# Altium schematic sheet CRSC0002.SchDoc: Critical system computer - Microcontroller
size A3; Engineer: Sam Shan Jiang; DocumentNumber: CRSC0002; SheetNumber: 2; SheetTotal: 5; Description: LPC2468 microcontroller; Version: 1.0
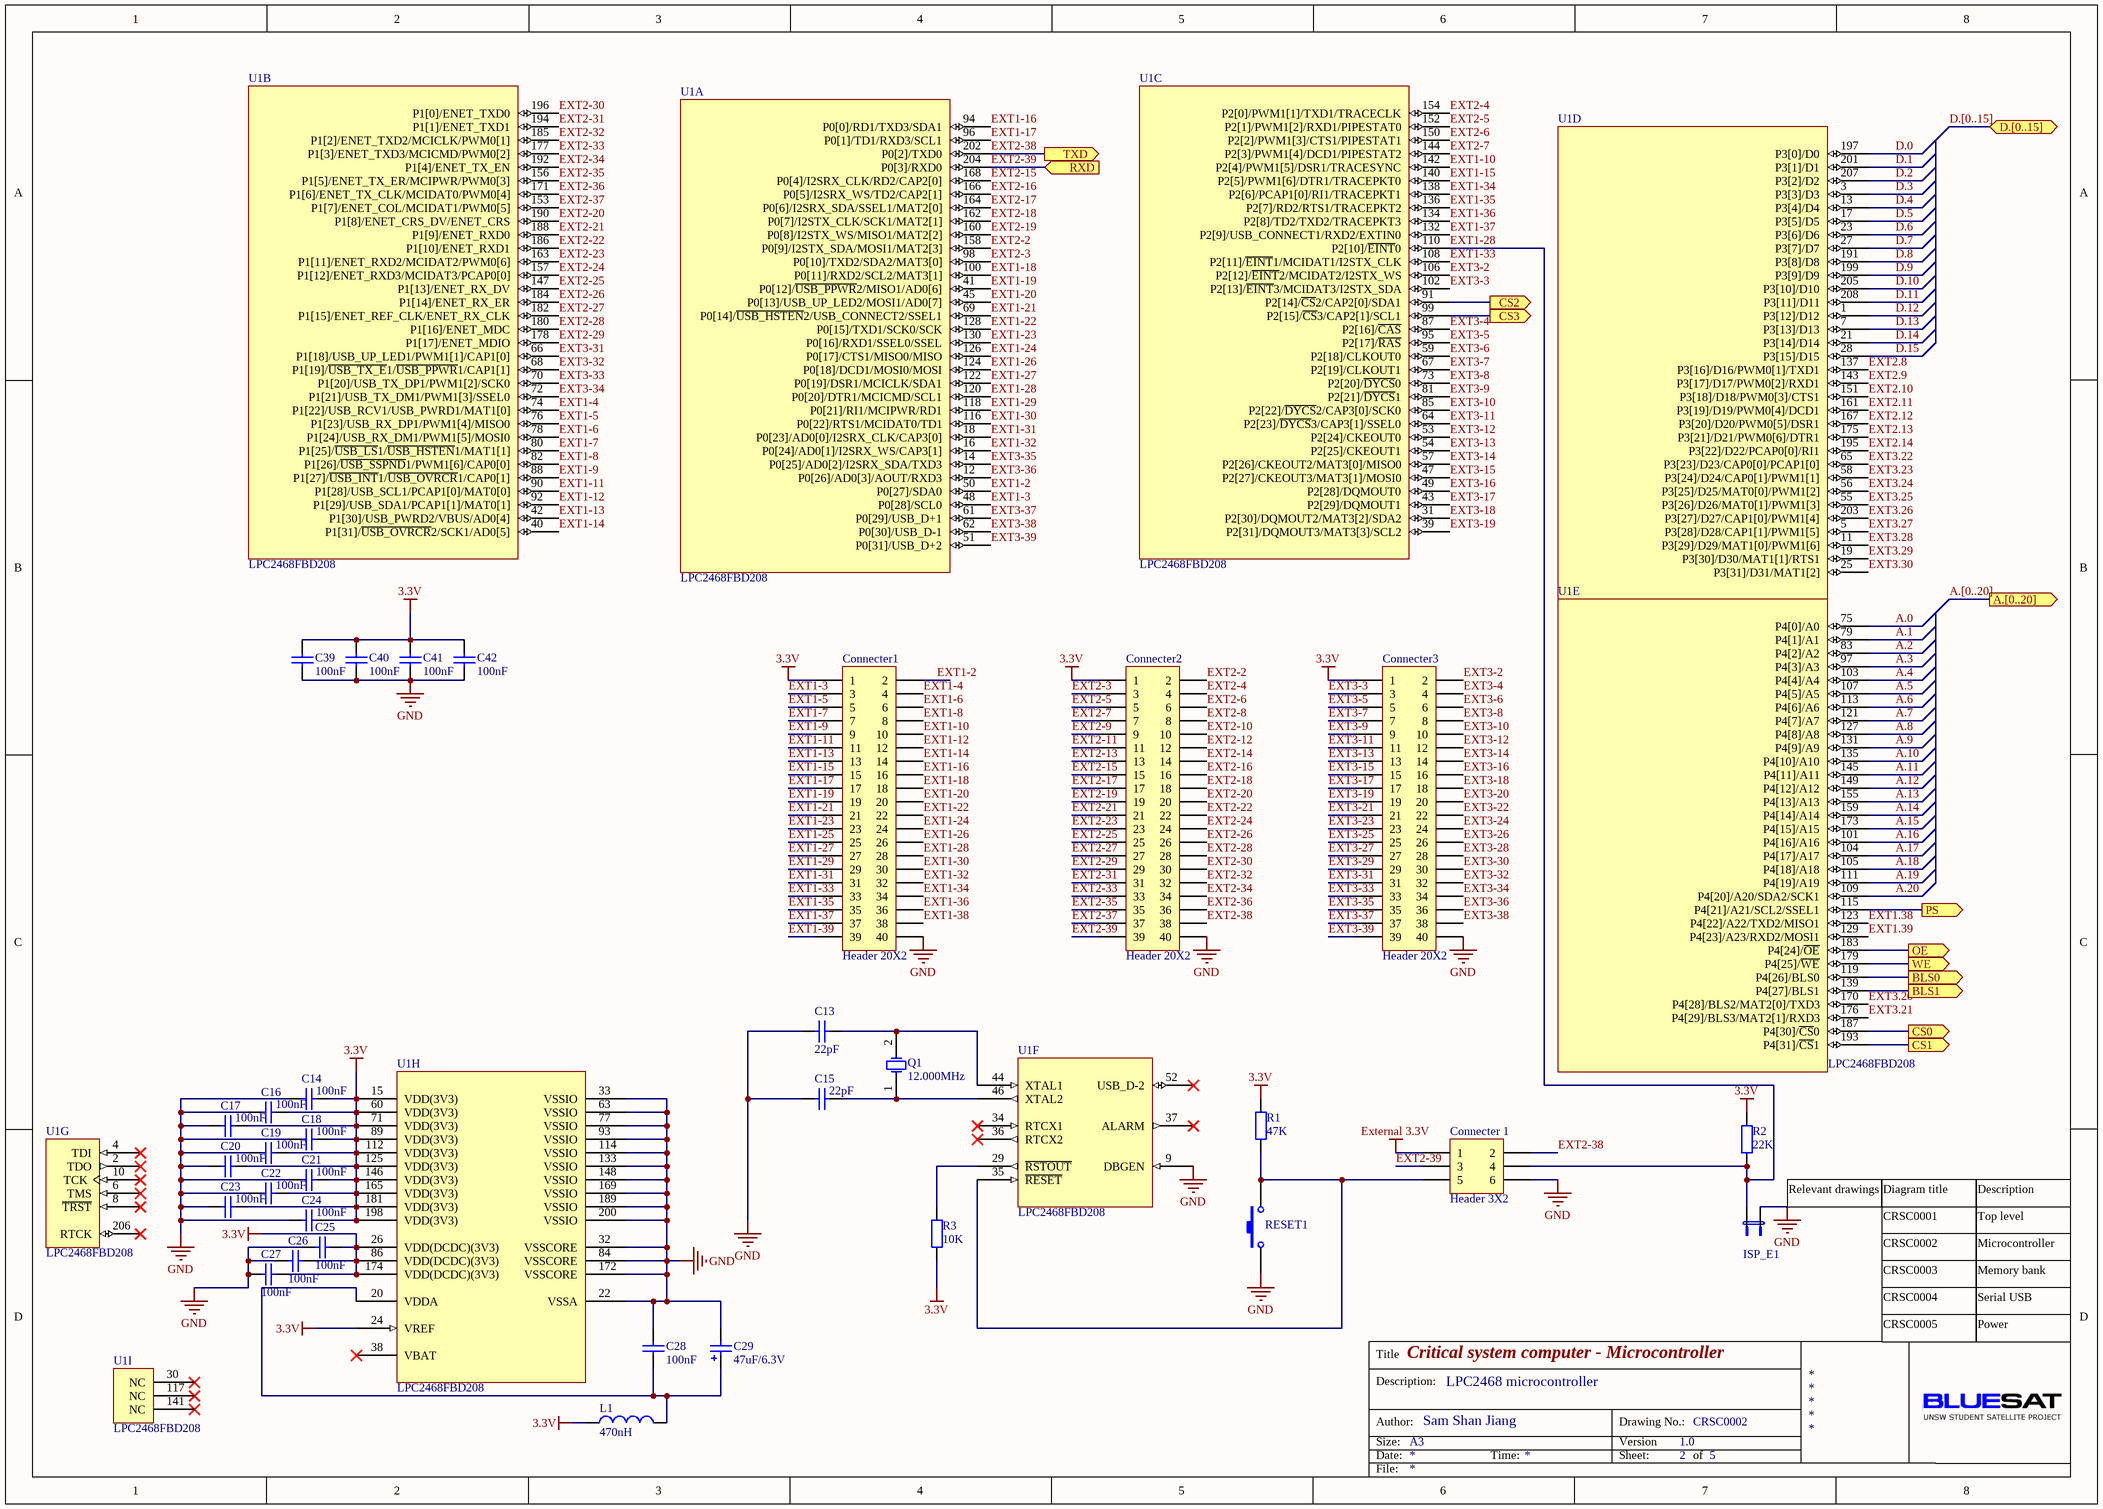
[diagram p0: CRSC0002.SchDoc]

## Parts
C13  22pF  [0805]
C14  100nF  [0805]
C15  22pF  [0805]
C16  100nF  [0805]
C17  100nF  [0805]
C18  100nF  [0805]
C19  100nF  [0805]
C20  100nF  [0805]
C21  100nF  [0805]
C22  100nF  [0805]
C23  100nF  [0805]
C24  100nF  [0805]
C25  100nF  [0805]
C26  100nF  [0805]
C27  100nF  [0805]
C28  100nF  [0805]
C29  47uF/6.3V  [1206]
C39  value 100nF  [0805]  (hidden comment: Cap)
C40  value 100nF  [0805]  (hidden comment: Cap)
C41  value 100nF  [0805]  (hidden comment: Cap)
C42  value 100nF  [0805]  (hidden comment: Cap)
Connecter1  Header 20X2  [40pins header]
Connecter2  Header 20X2  [40pins header]
Connecter3  Header 20X2  [40pins header]
Connecter_1  Header 3X2  [6pins header]
ISP_E1  2pins jumper  [JUMPER2pins]  (value not drawn)
L1  470nH  [0805]
Q1  12.000MHz  [HC49/4H_SMX]
R1  47K  [0805]
R2  22K  [0805]
R3  10K  [0805]
RESET1  SW-PB  [E-BIP-P4/D10]  (value not drawn)
U1  LPC2468FBD208  [SOT459-1_M]  (parts A,B,C,D,E,F,G,H,I of 9)

## Ports
A.[0..20] (out), BLS0 (out), BLS1 (out), CS0 (out), CS1 (out), CS2 (out), CS3 (out), D.[0..15] (bidir), OE (out), PS (out), RXD (in), TXD (out), WE (out)

## Nets
3.3V: C14.2 C16.2 C17.2 C18.2 C19.2 C20.2 C21.2 C22.2 C23.2 C24.2 C25.2 C26.2 C27.2 C39.2 C40.2 C41.2 C42.2 Connecter1.1 Connecter2.1 Connecter3.1 L1.1 R1.2 R2.2 R3.2 U1.15(VDD(3V3)) U1.24(VREF) U1.26(VDD(DCDC)(3V3)) U1.60(VDD(3V3)) U1.71(VDD(3V3)) U1.86(VDD(DCDC)(3V3)) U1.89(VDD(3V3)) U1.112(VDD(3V3)) U1.125(VDD(3V3)) U1.146(VDD(3V3)) U1.165(VDD(3V3)) U1.174(VDD(DCDC)(3V3)) U1.181(VDD(3V3)) U1.198(VDD(3V3))
External 3.3V: Connecter_1.1
GND: C13.2 C14.1 C15.2 C16.1 C17.1 C18.1 C19.1 C20.1 C21.1 C22.1 C23.1 C24.1 C25.1 C26.1 C27.1 C28.2 C29.2 C39.1 C40.1 C41.1 C42.1 Connecter1.40 Connecter2.40 Connecter3.40 Connecter_1.6 ISP_E1.2 RESET1.1 U1.9(DBGEN) U1.22(VSSA) U1.32(VSSCORE) U1.33(VSSIO) U1.63(VSSIO) U1.77(VSSIO) U1.84(VSSCORE) U1.93(VSSIO) U1.114(VSSIO) U1.133(VSSIO) U1.148(VSSIO) U1.169(VSSIO) U1.172(VSSCORE) U1.189(VSSIO) U1.200(VSSIO)
A.0: U1.75(P4[0]/A0)
A.1: U1.79(P4[1]/A1)
A.2: U1.83(P4[2]/A2)
A.3: U1.97(P4[3]/A3)
A.4: U1.103(P4[4]/A4)
A.5: U1.107(P4[5]/A5)
A.6: U1.113(P4[6]/A6)
A.7: U1.121(P4[7]/A7)
A.8: U1.127(P4[8]/A8)
A.9: U1.131(P4[9]/A9)
A.10: U1.135(P4[10]/A10)
A.11: U1.145(P4[11]/A11)
A.12: U1.149(P4[12]/A12)
A.13: U1.155(P4[13]/A13)
A.14: U1.159(P4[14]/A14)
A.15: U1.173(P4[15]/A15)
A.16: U1.101(P4[16]/A16)
A.17: U1.104(P4[17]/A17)
A.18: U1.105(P4[18]/A18)
A.19: U1.111(P4[19]/A19)
A.20: U1.109(P4[20]/A20/SDA2/SCK1)
BLS0: U1.119(P4[26]/BLS0) ; port BLS0
BLS1: U1.139(P4[27]/BLS1) ; port BLS1
CS0: U1.187(P4[30]/~{CS}0) ; port CS0
CS1: U1.193(P4[31]/~{CS}1) ; port CS1
CS2: U1.91(P2[14]/~{CS}2/CAP2[0]/SDA1) ; port CS2
CS3: U1.99(P2[15]/~{CS}3/CAP2[1]/SCL1) ; port CS3
D.0: U1.197(P3[0]/D0)
D.1: U1.201(P3[1]/D1)
D.2: U1.207(P3[2]/D2)
D.3: U1.3(P3[3]/D3)
D.4: U1.13(P3[4]/D4)
D.5: U1.17(P3[5]/D5)
D.6: U1.23(P3[6]/D6)
D.7: U1.27(P3[7]/D7)
D.8: U1.191(P3[8]/D8)
D.9: U1.199(P3[9]/D9)
D.10: U1.205(P3[10]/D10)
D.11: U1.208(P3[11]/D11)
D.12: U1.1(P3[12]/D12)
D.13: U1.7(P3[13]/D13)
D.14: U1.21(P3[14]/D14)
D.15: U1.28(P3[15]/D15)
EXT1-2: Connecter1.2 U1.50(P0[27]/SDA0)
EXT1-3: Connecter1.3 U1.48(P0[28]/SCL0)
EXT1-4: Connecter1.4 U1.74(P1[22]/USB_RCV1/USB_PWRD1/MAT1[0])
EXT1-5: Connecter1.5 U1.76(P1[23]/USB_RX_DP1/PWM1[4]/MISO0)
EXT1-6: Connecter1.6 U1.78(P1[24]/USB_RX_DM1/PWM1[5]/MOSI0)
EXT1-7: Connecter1.7 U1.80(P1[25]/~{USB_LS}1/~{USB_HSTEN}1/MAT1[1])
EXT1-8: Connecter1.8 U1.82(P1[26]/~{USB_SSPND}1/PWM1[6]/CAP0[0])
EXT1-9: Connecter1.9 U1.88(P1[27]/~{USB_INT}1/~{USB_OVRCR}1/CAP0[1])
EXT1-10: Connecter1.10 U1.142(P2[4]/PWM1[5]/DSR1/TRACESYNC)
EXT1-11: Connecter1.11 U1.90(P1[28]/USB_SCL1/PCAP1[0]/MAT0[0])
EXT1-12: Connecter1.12 U1.92(P1[29]/USB_SDA1/PCAP1[1]/MAT0[1])
EXT1-13: Connecter1.13 U1.42(P1[30]/USB_PWRD2/VBUS/AD0[4])
EXT1-14: Connecter1.14 U1.40(P1[31]/~{USB_OVRCR}2/SCK1/AD0[5])
EXT1-15: Connecter1.15 U1.140(P2[5]/PWM1[6]/DTR1/TRACEPKT0)
EXT1-16: Connecter1.16 U1.94(P0[0]/RD1/TXD3/SDA1)
EXT1-17: Connecter1.17 U1.96(P0[1]/TD1/RXD3/SCL1)
EXT1-18: Connecter1.18 U1.100(P0[11]/RXD2/SCL2/MAT3[1])
EXT1-19: Connecter1.19 U1.41(P0[12]/~{USB_PPWR}2/MISO1/AD0[6])
EXT1-20: Connecter1.20 U1.45(P0[13]/USB_UP_LED2/MOSI1/AD0[7])
EXT1-21: Connecter1.21 U1.69(P0[14]/~{USB_HSTEN}2/USB_CONNECT2/SSEL1)
EXT1-22: Connecter1.22 U1.128(P0[15]/TXD1/SCK0/SCK)
EXT1-23: Connecter1.23 U1.130(P0[16]/RXD1/SSEL0/SSEL)
EXT1-24: Connecter1.24 U1.126(P0[17]/CTS1/MISO0/MISO)
EXT1-25: Connecter1.25
EXT1-26: Connecter1.26 U1.124(P0[18]/DCD1/MOSI0/MOSI)
EXT1-27: Connecter1.27 U1.122(P0[19]/DSR1/MCICLK/SDA1)
EXT1-28: Connecter1.28 Connecter_1.4 ISP_E1.1 R2.1 U1.110(P2[10]/~{EINT}0) U1.120(P0[20]/DTR1/MCICMD/SCL1)
EXT1-29: Connecter1.29 U1.118(P0[21]/RI1/MCIPWR/RD1)
EXT1-30: Connecter1.30 U1.116(P0[22]/RTS1/MCIDAT0/TD1)
EXT1-31: Connecter1.31 U1.18(P0[23]/AD0[0]/I2SRX_CLK/CAP3[0])
EXT1-32: Connecter1.32 U1.16(P0[24]/AD0[1]/I2SRX_WS/CAP3[1])
EXT1-33: Connecter1.33 U1.108(P2[11]/~{EINT}1/MCIDAT1/I2STX_CLK)
EXT1-34: Connecter1.34 U1.138(P2[6]/PCAP1[0]/RI1/TRACEPKT1)
EXT1-35: Connecter1.35 U1.136(P2[7]/RD2/RTS1/TRACEPKT2)
EXT1-36: Connecter1.36 U1.134(P2[8]/TD2/TXD2/TRACEPKT3)
EXT1-37: Connecter1.37 U1.132(P2[9]/USB_CONNECT1/RXD2/EXTIN0)
EXT1-38: Connecter1.38
EXT1-39: Connecter1.39
EXT1.38: U1.123(P4[22]/A22/TXD2/MISO1)
EXT1.39: U1.129(P4[23]/A23/RXD2/MOSI1)
EXT2-2: Connecter2.2 U1.158(P0[9]/I2STX_SDA/MOSI1/MAT2[3])
EXT2-3: Connecter2.3 U1.98(P0[10]/TXD2/SDA2/MAT3[0])
EXT2-4: Connecter2.4 U1.154(P2[0]/PWM1[1]/TXD1/TRACECLK)
EXT2-5: Connecter2.5 U1.152(P2[1]/PWM1[2]/RXD1/PIPESTAT0)
EXT2-6: Connecter2.6 U1.150(P2[2]/PWM1[3]/CTS1/PIPESTAT1)
EXT2-7: Connecter2.7 U1.144(P2[3]/PWM1[4]/DCD1/PIPESTAT2)
EXT2-8: Connecter2.8
EXT2-9: Connecter2.9
EXT2-10: Connecter2.10
EXT2-11: Connecter2.11
EXT2-12: Connecter2.12
EXT2-13: Connecter2.13
EXT2-14: Connecter2.14
EXT2-15: Connecter2.15 U1.168(P0[4]/I2SRX_CLK/RD2/CAP2[0])
EXT2-16: Connecter2.16 U1.166(P0[5]/I2SRX_WS/TD2/CAP2[1])
EXT2-17: Connecter2.17 U1.164(P0[6]/I2SRX_SDA/SSEL1/MAT2[0])
EXT2-18: Connecter2.18 U1.162(P0[7]/I2STX_CLK/SCK1/MAT2[1])
EXT2-19: Connecter2.19 U1.160(P0[8]/I2STX_WS/MISO1/MAT2[2])
EXT2-20: Connecter2.20 U1.190(P1[8]/ENET_CRS_DV/ENET_CRS)
EXT2-21: Connecter2.21 U1.188(P1[9]/ENET_RXD0)
EXT2-22: Connecter2.22 U1.186(P1[10]/ENET_RXD1)
EXT2-23: Connecter2.23 U1.163(P1[11]/ENET_RXD2/MCIDAT2/PWM0[6])
EXT2-24: Connecter2.24 U1.157(P1[12]/ENET_RXD3/MCIDAT3/PCAP0[0])
EXT2-25: Connecter2.25 U1.147(P1[13]/ENET_RX_DV)
EXT2-26: Connecter2.26 U1.184(P1[14]/ENET_RX_ER)
EXT2-27: Connecter2.27 U1.182(P1[15]/ENET_REF_CLK/ENET_RX_CLK)
EXT2-28: Connecter2.28 U1.180(P1[16]/ENET_MDC)
EXT2-29: Connecter2.29 U1.178(P1[17]/ENET_MDIO)
EXT2-30: Connecter2.30 U1.196(P1[0]/ENET_TXD0)
EXT2-31: Connecter2.31 U1.194(P1[1]/ENET_TXD1)
EXT2-32: Connecter2.32 U1.185(P1[2]/ENET_TXD2/MCICLK/PWM0[1])
EXT2-33: Connecter2.33 U1.177(P1[3]/ENET_TXD3/MCICMD/PWM0[2])
EXT2-34: Connecter2.34 U1.192(P1[4]/ENET_TX_EN)
EXT2-35: Connecter2.35 U1.156(P1[5]/ENET_TX_ER/MCIPWR/PWM0[3])
EXT2-36: Connecter2.36 U1.171(P1[6]/ENET_TX_CLK/MCIDAT0/PWM0[4])
EXT2-37: Connecter2.37 U1.153(P1[7]/ENET_COL/MCIDAT1/PWM0[5])
EXT2-38: Connecter2.38 Connecter_1.2 U1.202(P0[2]/TXD0) ; port TXD
EXT2-39: Connecter2.39 Connecter_1.3 U1.204(P0[3]/RXD0) ; port RXD
EXT2.8: U1.137(P3[16]/D16/PWM0[1]/TXD1)
EXT2.9: U1.143(P3[17]/D17/PWM0[2]/RXD1)
EXT2.10: U1.151(P3[18]/D18/PWM0[3]/CTS1)
EXT2.11: U1.161(P3[19]/D19/PWM0[4]/DCD1)
EXT2.12: U1.167(P3[20]/D20/PWM0[5]/DSR1)
EXT2.13: U1.175(P3[21]/D21/PWM0[6]/DTR1)
EXT2.14: U1.195(P3[22]/D22/PCAP0[0]/RI1)
EXT3-2: Connecter3.2 U1.106(P2[12]/~{EINT}2/MCIDAT2/I2STX_WS)
EXT3-3: Connecter3.3 U1.102(P2[13]/~{EINT}3/MCIDAT3/I2STX_SDA)
EXT3-4: Connecter3.4 U1.87(P2[16]/~{CAS})
EXT3-5: Connecter3.5 U1.95(P2[17]/~{RAS})
EXT3-6: Connecter3.6 U1.59(P2[18]/CLKOUT0)
EXT3-7: Connecter3.7 U1.67(P2[19]/CLKOUT1)
EXT3-8: Connecter3.8 U1.73(P2[20]/~{DYCS}0)
EXT3-9: Connecter3.9 U1.81(P2[21]/~{DYCS}1)
EXT3-10: Connecter3.10 U1.85(P2[22]/~{DYCS}2/CAP3[0]/SCK0)
EXT3-11: Connecter3.11 U1.64(P2[23]/~{DYCS}3/CAP3[1]/SSEL0)
EXT3-12: Connecter3.12 U1.53(P2[24]/CKEOUT0)
EXT3-13: Connecter3.13 U1.54(P2[25]/CKEOUT1)
EXT3-14: Connecter3.14 U1.57(P2[26]/CKEOUT2/MAT3[0]/MISO0)
EXT3-15: Connecter3.15 U1.47(P2[27]/CKEOUT3/MAT3[1]/MOSI0)
EXT3-16: Connecter3.16 U1.49(P2[28]/DQMOUT0)
EXT3-17: Connecter3.17 U1.43(P2[29]/DQMOUT1)
EXT3-18: Connecter3.18 U1.31(P2[30]/DQMOUT2/MAT3[2]/SDA2)
EXT3-19: Connecter3.19 U1.39(P2[31]/DQMOUT3/MAT3[3]/SCL2)
EXT3-20: Connecter3.20
EXT3-21: Connecter3.21
EXT3-22: Connecter3.22
EXT3-23: Connecter3.23
EXT3-24: Connecter3.24
EXT3-25: Connecter3.25
EXT3-26: Connecter3.26
EXT3-27: Connecter3.27
EXT3-28: Connecter3.28
EXT3-29: Connecter3.29
EXT3-30: Connecter3.30
EXT3-31: Connecter3.31 U1.66(P1[18]/USB_UP_LED1/PWM1[1]/CAP1[0])
EXT3-32: Connecter3.32 U1.68(P1[19]/~{USB_TX_E}1/~{USB_PPWR}1/CAP1[1])
EXT3-33: Connecter3.33 U1.70(P1[20]/USB_TX_DP1/PWM1[2]/SCK0)
EXT3-34: Connecter3.34 U1.72(P1[21]/USB_TX_DM1/PWM1[3]/SSEL0)
EXT3-35: Connecter3.35 U1.14(P0[25]/AD0[2]/I2SRX_SDA/TXD3)
EXT3-36: Connecter3.36 U1.12(P0[26]/AD0[3]/AOUT/RXD3)
EXT3-37: Connecter3.37 U1.61(P0[29]/USB_D+1)
EXT3-38: Connecter3.38 U1.62(P0[30]/USB_D-1)
EXT3-39: Connecter3.39 U1.51(P0[31]/USB_D+2)
EXT3.20: U1.170(P4[28]/BLS2/MAT2[0]/TXD3)
EXT3.21: U1.176(P4[29]/BLS3/MAT2[1]/RXD3)
EXT3.22: U1.65(P3[23]/D23/CAP0[0]/PCAP1[0])
EXT3.23: U1.58(P3[24]/D24/CAP0[1]/PWM1[1])
EXT3.24: U1.56(P3[25]/D25/MAT0[0]/PWM1[2])
EXT3.25: U1.55(P3[26]/D26/MAT0[1]/PWM1[3])
EXT3.26: U1.203(P3[27]/D27/CAP1[0]/PWM1[4])
EXT3.27: U1.5(P3[28]/D28/CAP1[1]/PWM1[5])
EXT3.28: U1.11(P3[29]/D29/MAT1[0]/PWM1[6])
EXT3.29: U1.19(P3[30]/D30/MAT1[1]/RTS1)
EXT3.30: U1.25(P3[31]/D31/MAT1[2])
OE: U1.183(P4[24]/~{OE}) ; port OE
PS: U1.115(P4[21]/A21/SCL2/SSEL1) ; port PS
WE: U1.179(P4[25]/~{WE}) ; port WE
NetC13_1: C13.1 Q1.2(OSC2) U1.44(XTAL1)
NetC15_1: C15.1 Q1.1(OSC1) U1.46(XTAL2)
NetC28_1: C28.1 C29.1 L1.2 U1.20(VDDA)
NetConnecter_1_5: Connecter_1.5 R1.1 RESET1.2 U1.35(~{RESET})
NetR3_1: R3.1 U1.29(~{RSTOUT})

Not connected (* = marked no-connect by the designer): U1 2(TDO)* 4(TDI)* 6(TMS)* 8(~{TRST})* 10(TCK)* 30(NC)* 34(RTCX1)* 36(RTCX2)* 37(ALARM)* 38(VBAT)* 52(USB_D-2)* 117(NC)* 141(NC)* 206(RTCK)*

## Buses and harness runs
bus A.[0..20] = port A.[0..20]
bus D.[0..15] = port D.[0..15]

## Notes on the sheet
- Relevant drawings
- CRSC0001
- CRSC0002
- Diagram title
- Top level
- Microcontroller
- Description
- CRSC0003
- CRSC0004
- Memory bank
- Serial USB
- CRSC0005
- Power
- Title
- Description:
- Size:
- Author:
- Date:
- A3
- Time:
- Version
- Sheet:
- Drawing No.:
- of
- File:

## Library data of the parts
C13-C28 = Cap: Capacitor; Manufacturer: Generic Components; Class: Passive; Published: 08/06/2000; Publisher: Altium Hobart Technology Centre; SubClass: Capacitor
  C13 C15: Value: 22pF
  C14 C16-C28: Value: 100nF
C29 = Cap Pol3: Polarized Capacitor (Surface Mount); Published: 8-Jun-2000; LatestRevisionDate: 29-May-2009; LatestRevisionNote: IPC-7351 Footprint Added.; PackageReference: C0805; Publisher: Altium Limited; PackageDescription: Chip Capacitor; Value: 47uF/6.3V
C39-C42 = Cap: Capacitor; Published: 8-Jun-2000; LatestRevisionDate: 17-Jul-2002; LatestRevisionNote: Re-released for DXP Platform.; PackageReference: RAD-0.3; Publisher: Altium Limited
Connecter1-Connecter3 = Header 20X2: Header, 20-Pin, Dual row; Manufacturer: Generic Components; Class: Connector
Connecter_1 = Header 3X2: Header, 5-Pin, Dual row; Manufacturer: Generic Components; Class: Connector
L1 = Inductor: Code_IEC: 1005; Published: 8-Jun-2000; LatestRevisionDate: 29-May-2009; LatestRevisionNote: IPC-7351 Footprint Added.; PackageReference: 0402-A; Publisher: Altium Limited; PackageDescription: Chip Inductor; Code_JEITA: 0402; Value: 470nH
Q1 = C.O. 2pins: Crystal Oscillator; Published: 8-Jun-2000; LatestRevisionDate: 17-Jul-2002; LatestRevisionNote: Re-released for DXP Platform.; PackageReference: R38; Publisher: Altium Limited
R1-R3 = Res2: Resistor; Manufacturer: Generic Components; Class: Passive; Published: 08/06/2000; Publisher: Altium Hobart Technology Centre; SubClass: Resistor
  R1: Value: 47K
  R2: Value: 22K
  R3: Value: 10K
RESET1 = SW-PB: Switch; Manufacturer: Generic Components; Published: 1999
U1 = LPC2468FBD208: ARM7 16/32-Bit Microcontroller, 512KB Flash, 98KB RAM, 208-Lead LQFP; Code_IEC: 136E30; Published: 17-Aug-2007; DatasheetVersion: rev.01, Jul-2007; PackageVersion: Feb-2003; PackageReference: SOT459-1; Publisher: Altium Limited; PackageDescription: 208-Pin Plastic Low Profile Quad Flat Pack, LQFP208; Code_JEDEC: MS-026; ComponentLink1Description: Manufacturer Link; ComponentLink1URL: http://www.nxp.com/; ComponentLink2Description: Datasheet; ComponentLink2URL: http://www.standardics.nxp.com/products/lpc2000/datasheet/lpc2468.pdf